# Altium project 2015_AdaptateurBluetooth.PrjPcb
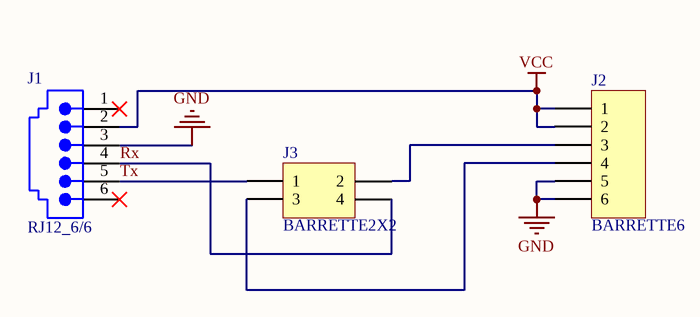
[diagram p0: 2015_AdaptateurBluetooth.SchDoc]
1 sheet, 3 parts. Net scope: global (net labels, ports and power ports of the same name join across sheets).
Board file: 2015_AdaptateurBluetooth.PcbDoc

## Sheet 2015_AdaptateurBluetooth.SchDoc
size A4

### Parts
J1  RJ12_6/6  [RJ12_6/6]
J2  BARRETTE6  [BARRETTE_6_F_D]
J3  BARRETTE2X2  [BARRETTE_2X2_F_D]

### Nets
GND: J1.3 J2.5 J2.6
VCC: J1.2 J2.1 J2.2
Rx: J1.4 J3.4
Tx: J1.5 J3.1
NetJ2_3: J2.3 J3.2
NetJ2_4: J2.4 J3.3

Not connected (* = marked no-connect by the designer): J1 1* 6*

### Notes on the sheet
- Title
- Size:
- Date:
- A4
- Number:
- Time:
- Revision:
- Sheet
- of
- File:

### Library data of the parts
J1 = RJ12_6/6: EMBASE RJ12_6/6 COUDEE; Type: RJ12_6/6
J2 = BARRETTE6: Header, 6-Pin; LatestRevisionDate: 17-Jul-2002; LatestRevisionNote: Re-released for DXP Platform.; Publisher: Altium Limited
J3 = BARRETTE2X2: Header, 2-Pin, Dual row; LatestRevisionDate: 17-Jul-2002; LatestRevisionNote: Re-released for DXP Platform.; Publisher: Altium Limited